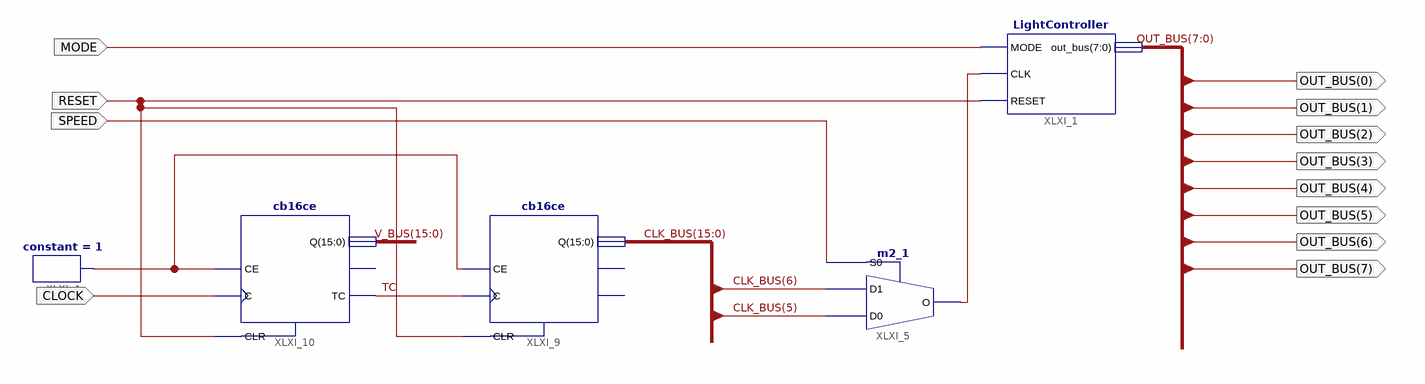
[diagram p0: schematic sheet 1]
// Xilinx ISE schematic TopLevel.sch (spartan3a) as structural Verilog: 5 symbols, 12 ports
module TopLevel (
  input  CLOCK,
  input  SPEED,
  input  MODE,
  input  RESET,
  output [7:0] OUT_BUS
);

  wire A, const_1, TC;
  wire [15:0] CLK_BUS, V_BUS;

  LightController XLXI_1 (.MODE(MODE), .CLK(A), .RESET(RESET), .out_bus(OUT_BUS));
  constant #(.CValue("1")) XLXI_4 (.O(const_1));
  m2_1 XLXI_5 (.D0(CLK_BUS[5]), .D1(CLK_BUS[6]), .S0(SPEED), .O(A));
  cb16ce XLXI_9 (.C(TC), .CE(const_1), .CLR(RESET), .Q(CLK_BUS));  // open: CEO, TC
  cb16ce XLXI_10 (.C(CLOCK), .CE(const_1), .CLR(RESET), .Q(V_BUS), .TC(TC));  // open: CEO
endmodule
